# EAGLE design MouseGoggles HatBrd-1-1 (EAGLE 9.6.2)
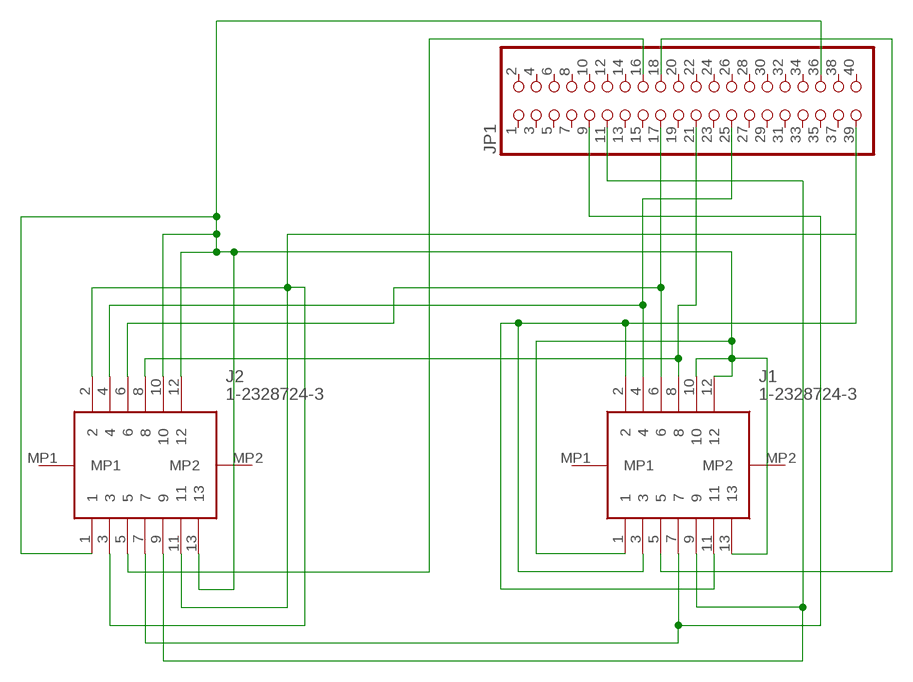
[diagram p0: schematic, sheet 1]

## Parts
J1  1-2328724-3  [123287243]
J2  1-2328724-3  [123287243]
JP1  PINHD-2X20-BIG  [2X20-BIG]

## Nets
N$1: J1.2 J1.3 J1.11 J2.2 J2.3 J2.11 JP1.39
N$4: J1.8 J2.8 JP1.21
N$5: J1.6 J2.6 JP1.17
N$6: J1.5 JP1.18
N$7: J1.1 J1.10 J1.12 J1.13 J2.1 J2.10 J2.12 J2.13 JP1.36
N$8: J1.4 J2.4 JP1.25
N$9: J1.7 J2.7 JP1.9
N$15: J1.9 J2.9 JP1.11
N$16: J2.5 JP1.16
Unconnected: J1.MP1 J1.MP2 J2.MP1 J2.MP2 JP1.1 JP1.2 JP1.3 JP1.4 JP1.5 JP1.6 JP1.7 JP1.8 JP1.10 JP1.12 JP1.13 JP1.14 JP1.15 JP1.19 JP1.20 JP1.22 JP1.23 JP1.24 JP1.26 JP1.27 JP1.28 JP1.29 JP1.30 JP1.31 JP1.32 JP1.33 JP1.34 JP1.35 JP1.37 JP1.38 JP1.40

## Library data of the parts
J1 J2 = 1-2328724-3:1-2328724-3: AMP - TE CONNECTIVITY - 1-2328724-3 - CONNECTOR, FPC, R/A, 13POS, 1ROW, 0.3MM Source: Datasheet <https://www.te.com/commerce/DocumentDelivery/DDEController?Action=showdoc&DocId=Customer Drawing23287243pdfEnglishENG_CD_2328724_3.pdf1-2328724-3>; DESCRIPTION: AMP - TE CONNECTIVITY - 1-2328724-3 - CONNECTOR, FPC, R/A, 13POS, 1ROW, 0.3MM; HEIGHT: 1.1mm; MANUFACTURER_NAME: TE Connectivity; MANUFACTURER_PART_NUMBER: 1-2328724-3; MOUSER_PART_NUMBER: 571-1-2328724-3; MOUSER_PRICE-STOCK: https://www.mouser.co.uk/ProductDetail/TE-Connectivity/1-2328724-3?qs=w%2Fv1CP2dgqo8aBCjMy0R7g%3D%3D
JP1 = adafruit:PINHD-2X20: PIN HEADER

## Board
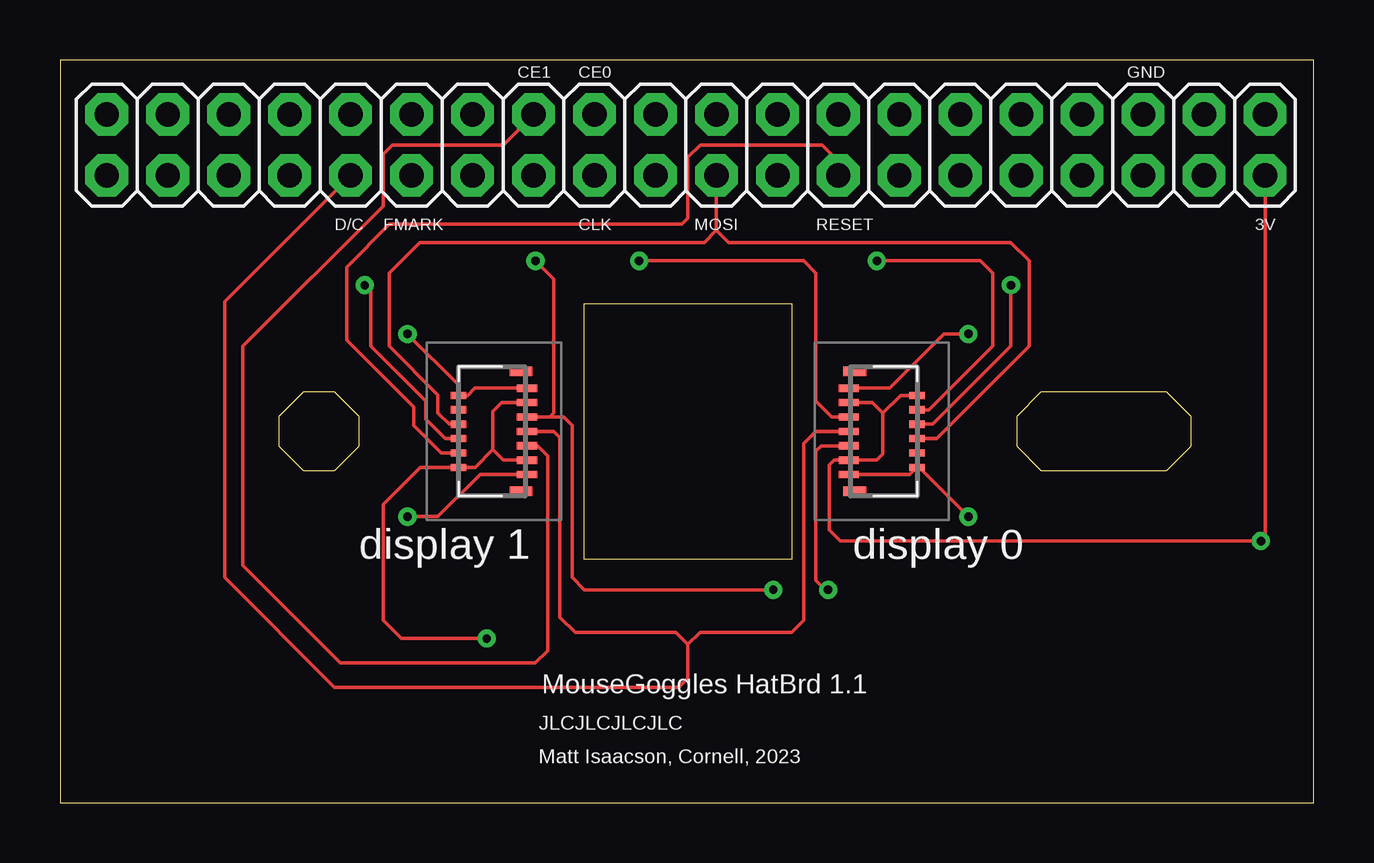
[diagram p1: board, top side]
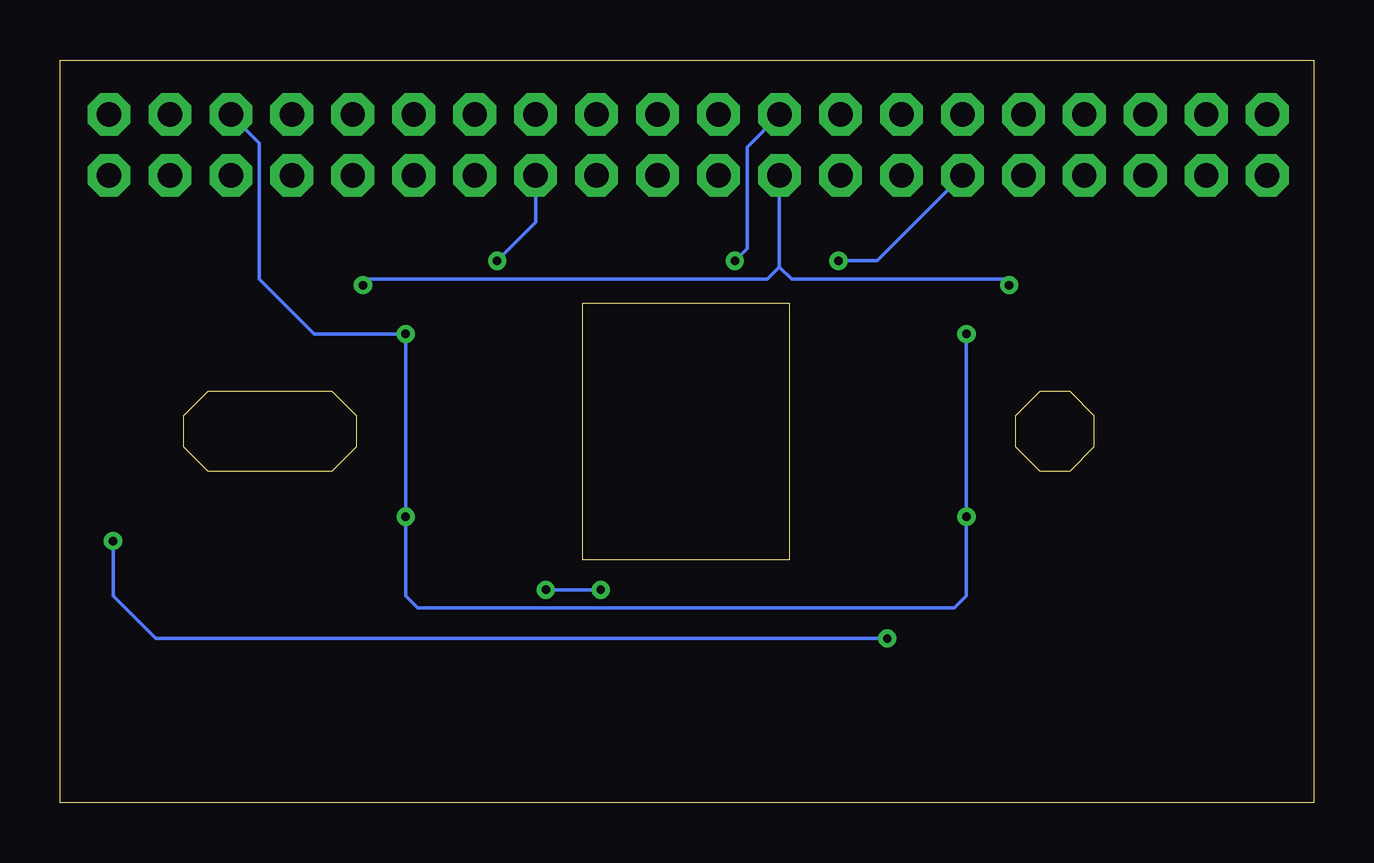
[diagram p2: board, bottom side, seen from below]

Size 52.25 x 30.98 mm. Coordinates in mm from the lower left corner, seen from the top.
Outline: 0,0 52.25,0 52.25,30.98 0,30.98 0,0
Outline: 21.84,20.83 30.48,20.83 30.48,10.16 21.84,10.16 21.84,20.83
Outline: 11.43,17.14 12.45,16.13 12.45,14.86 11.43,13.84 10.16,13.84 9.14,14.86 9.14,16.13 10.16,17.14 11.43,17.14
Outline: 39.88,16.13 40.89,17.14 46.1,17.14 47.12,16.13 47.12,14.86 46.1,13.84 40.89,13.84 39.88,14.86 39.88,16.13
Copper layers (1*16): Top 0.035mm / dielectric 1.5mm / Bottom 0.035mm
Design rules "default": minimum track width 6mil, minimum drill 0.35mm, track to track 6mil, track to pad 6mil, pad to pad 6mil, via to via 6mil, smd to smd 6mil, copper to edge 40mil, drill to drill 6mil, minimum pad ring 10mil, minimum via ring 8mil, stop-mask expansion 4mil, vias tented up to drill 0mil, thermal gap 10mil

### Footprints (pad centres in the part's own frame; a part is rotated, then mirrored left to right if it is on the bottom)
123287243 = smd 0.3 x 0.85: 1 -1.8,-1.425; 3 -1.2,-1.425; 5 -0.6,-1.425; 7 0,-1.425; 9 0.6,-1.425; 11 1.2,-1.425; 13 1.8,-1.425 | smd 0.3 x 0.65: 2 -1.5,1.425; 4 -0.9,1.425; 6 -0.3,1.425; 8 0.3,1.425; 10 0.9,1.425; 12 1.5,1.425 | smd 0.4 x 0.95: MP1 -2.5,-1.175; MP2 2.5,-1.175
2X20-BIG = drill 1.016 pad 1.778 octagon: 1 -24.13,-1.27; 2 -24.13,1.27; 3 -21.59,-1.27; 4 -21.59,1.27; 5 -19.05,-1.27; 6 -19.05,1.27; 7 -16.51,-1.27; 8 -16.51,1.27; 9 -13.97,-1.27; 10 -13.97,1.27; 11 -11.43,-1.27; 12 -11.43,1.27; 13 -8.89,-1.27; 14 -8.89,1.27; 15 -6.35,-1.27; 16 -6.35,1.27; 17 -3.81,-1.27; 18 -3.81,1.27; 19 -1.27,-1.27; 20 -1.27,1.27; 21 1.27,-1.27; 22 1.27,1.27; 23 3.81,-1.27; 24 3.81,1.27; 25 6.35,-1.27; 26 6.35,1.27; 27 8.89,-1.27; 28 8.89,1.27; 29 11.43,-1.27; 30 11.43,1.27; 31 13.97,-1.27; 32 13.97,1.27; 33 16.51,-1.27; 34 16.51,1.27; 35 19.05,-1.27; 36 19.05,1.27; 37 21.59,-1.27; 38 21.59,1.27; 39 24.13,-1.27; 40 24.13,1.27

### Placement (x,y rotation side)
J1  34.29,15.49 270 top
J2  18.03,15.49 90 top
JP1  26.08,27.43 0 top

### Tracks (layer width: path | path; a pad name or v marks a point on that pad's centre or on a via)
N$1  (via drill 0.35)
  Top 0.152: J1.2 35.03,16.99 34.29,16.26 | J1.3 33.85,16.69 34.29,16.26 | 18.03,14.73 17.3,13.99 J2.2 15.01,13.99 13.46,12.45 13.46,7.62 14.22,6.86 v17.78,6.86 | J2.3 18.47,14.29 18.03,14.73 | J2.11 18.41,16.69 18.03,16.31 18.03,14.73 | JP1.39 50.21,11.09 v50.04,10.92 32.51,10.92 32.05,11.38 32.05,14.09 32.26,14.29 J1.11 34.04,14.29 34.29,14.55 34.29,16.26
  Bottom 0.152: v50.04,10.92 50.04,8.64 48.26,6.86 v17.78,6.86
N$4
  Top 0.152: JP1.21 27.35,23.88 | J1.8 36.53,15.19 40.39,19.05 40.39,22.61 39.62,23.37 27.94,23.37 27.86,23.37 27.35,23.88 | J2.8 16.21,15.79 15.75,16.26 15.75,17.02 13.72,19.05 13.72,22.1 14.99,23.37 26.84,23.37 27.35,23.88
N$5  (via drill 0.35)
  Top 0.152: v12.7,21.59 12.95,21.34 12.95,19.05 15.24,16.76 15.24,16 16.05,15.19 J2.6 | v39.62,21.59 39.62,19.05 36.37,15.79 J1.6
  Bottom 0.152: v12.7,21.59 12.95,21.84 21.76,21.84 22.27,22.35 | JP1.17 22.27,22.35 | v39.62,21.59 39.37,21.84 22.86,21.84 22.78,21.84 22.27,22.35
N$6  (via drill 0.35)
  Top 0.152: J1.5 32.17,16.09 31.5,16.76 31.5,22.1 30.99,22.61 v24.13,22.61
  Bottom 0.152: JP1.18 23.62,27.35 23.62,23.11 v24.13,22.61
N$7  (via drill 0.35)
  Top 0.152: J1.13 35.41,13.69 J1.12 J1.10 35.72,14.07 v37.85,11.94 | J2.10 J2.12 | J2.12 16.99,16.99 17.29,17.29 J2.13 | J2.1 17.5,13.69 15.75,11.94 v14.48,11.94 | J2.12 16.61,17.43 v14.48,19.56 | J1.1 34.57,17.29 36.83,19.56 v37.85,19.56
  Bottom 0.152: v14.48,19.56 v14.48,11.94 14.48,8.64 14.99,8.13 37.34,8.13 37.85,8.64 v37.85,11.94 v37.85,19.56 41.66,19.56 43.94,21.84 43.94,27.52 JP1.36
N$8  (via drill 0.35)
  Top 0.152: JP1.25 32.43,26.75 31.75,27.43 26.67,27.43 26.16,26.92 26.16,24.38 25.91,24.13 13.72,24.13 11.94,22.35 11.94,19.3 14.73,16.51 14.73,15.75 15.89,14.59 J2.4 | J1.4 36.21,16.39 38.86,19.05 38.86,22.1 38.35,22.61 v34.04,22.61
  Bottom 0.152: v34.04,22.61 32.43,24.21 JP1.25
N$9
  Top 0.152: JP1.9 6.86,20.91 6.86,9.4 11.43,4.83 25.78,4.83 26.16,5.21 26.16,6.6 | J2.7 20.57,15.49 20.83,15.24 20.83,7.75 21.46,7.11 25.65,7.11 26.16,6.6 | J1.7 31.5,15.49 30.99,14.99 30.99,7.62 30.48,7.11 26.67,7.11 26.16,6.6
N$15  (via drill 0.35)
  Top 0.152: v19.81,22.61 20.57,21.84 20.57,16.26 20.41,16.09 | v32,8.89 31.88,8.89 31.5,9.27 31.5,14.67 31.72,14.89 J1.9 | v29.72,8.89 21.84,8.89 21.34,9.4 21.34,15.75 20.99,16.09 20.41,16.09 | 20.41,16.09 J2.9
  Bottom 0.152: JP1.11 18.2,22.61 v19.81,22.61 | v32,8.89 v29.72,8.89
N$16
  Top 0.152: JP1.16 18.46,27.43 13.84,27.43 13.46,27.05 13.46,24.89 7.62,19.05 7.62,9.91 11.68,5.84 19.81,5.84 20.32,6.35 20.32,14.48 19.9,14.89 J2.5

### Text on the board
tNames: CE1 | CE0 | GND | D/C | FMARK | CLK | MOSI | RESET | 3V | display 1 | display 0 | MouseGoggles HatBrd 1.1 | JLCJLCJLCJLC | Matt Isaacson, Cornell, 2023